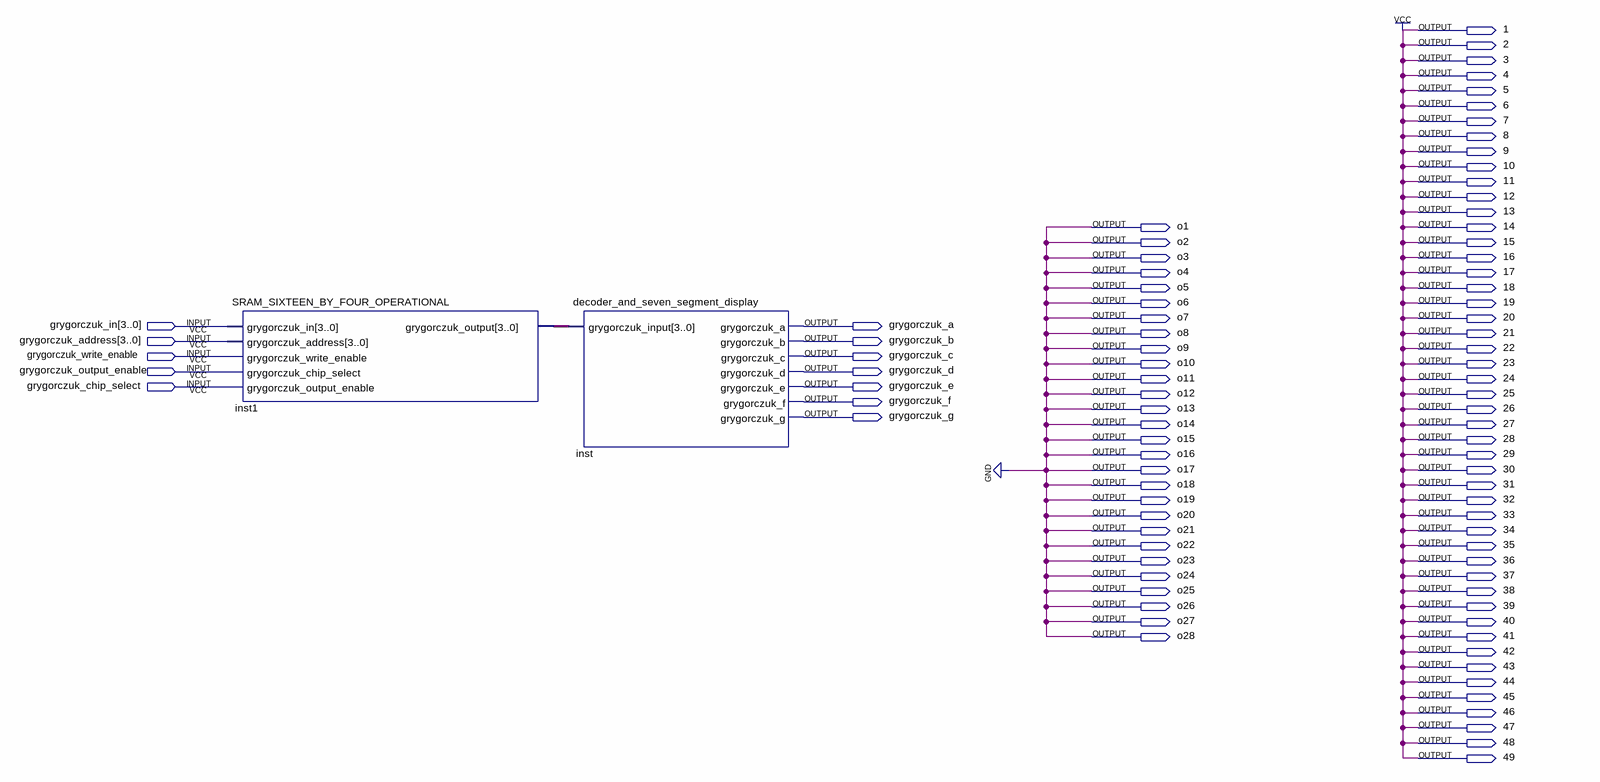
[diagram p0: schematic sheet]
// Quartus schematic SRAM_PINS.bdf as structural Verilog: 2 symbols, 89 pins
module SRAM_PINS (
  input  [3:0] grygorczuk_in,
  input  [3:0] grygorczuk_address,
  input  grygorczuk_write_enable,
  input  grygorczuk_output_enable,
  input  grygorczuk_chip_select,
  output \1 ,
  output \2 ,
  output \3 ,
  output \4 ,
  output \5 ,
  output \6 ,
  output \7 ,
  output \8 ,
  output \9 ,
  output \10 ,
  output \11 ,
  output \12 ,
  output \13 ,
  output o1,
  output \14 ,
  output o2,
  output \15 ,
  output o3,
  output \16 ,
  output o4,
  output \17 ,
  output o5,
  output \18 ,
  output o6,
  output \19 ,
  output o7,
  output \20 ,
  output grygorczuk_a,
  output o8,
  output \21 ,
  output grygorczuk_b,
  output o9,
  output \22 ,
  output grygorczuk_c,
  output o10,
  output \23 ,
  output grygorczuk_d,
  output o11,
  output \24 ,
  output grygorczuk_e,
  output o12,
  output \25 ,
  output grygorczuk_f,
  output o13,
  output \26 ,
  output grygorczuk_g,
  output o14,
  output \27 ,
  output o15,
  output \28 ,
  output o16,
  output \29 ,
  output o17,
  output \30 ,
  output o18,
  output \31 ,
  output o19,
  output \32 ,
  output o20,
  output \33 ,
  output o21,
  output \34 ,
  output o22,
  output \35 ,
  output o23,
  output \36 ,
  output o24,
  output \37 ,
  output o25,
  output \38 ,
  output o26,
  output \39 ,
  output o27,
  output \40 ,
  output o28,
  output \41 ,
  output \42 ,
  output \43 ,
  output \44 ,
  output \45 ,
  output \46 ,
  output \47 ,
  output \48 ,
  output \49 
);

  wire [3:0] inst1_grygorczuk_output;

  SRAM_SIXTEEN_BY_FOUR_OPERATIONAL inst1 (
    .grygorczuk_in(grygorczuk_in), .grygorczuk_address(grygorczuk_address),
    .grygorczuk_write_enable(grygorczuk_write_enable), .grygorczuk_chip_select(grygorczuk_output_enable),
    .grygorczuk_output_enable(grygorczuk_chip_select), .grygorczuk_output(inst1_grygorczuk_output));
  decoder_and_seven_segment_display inst (
    .grygorczuk_input(inst1_grygorczuk_output), .grygorczuk_a(grygorczuk_a), .grygorczuk_b(grygorczuk_b),
    .grygorczuk_c(grygorczuk_c), .grygorczuk_d(grygorczuk_d), .grygorczuk_e(grygorczuk_e),
    .grygorczuk_f(grygorczuk_f), .grygorczuk_g(grygorczuk_g));

  assign \1  = 1'b1;
  assign \2  = 1'b1;
  assign \3  = 1'b1;
  assign \4  = 1'b1;
  assign \5  = 1'b1;
  assign \6  = 1'b1;
  assign \7  = 1'b1;
  assign \8  = 1'b1;
  assign \9  = 1'b1;
  assign \10  = 1'b1;
  assign \11  = 1'b1;
  assign \12  = 1'b1;
  assign \13  = 1'b1;
  assign \14  = 1'b1;
  assign \15  = 1'b1;
  assign \16  = 1'b1;
  assign \17  = 1'b1;
  assign \18  = 1'b1;
  assign \19  = 1'b1;
  assign \20  = 1'b1;
  assign \21  = 1'b1;
  assign \22  = 1'b1;
  assign \23  = 1'b1;
  assign \24  = 1'b1;
  assign \25  = 1'b1;
  assign \26  = 1'b1;
  assign \27  = 1'b1;
  assign \28  = 1'b1;
  assign \29  = 1'b1;
  assign \30  = 1'b1;
  assign \31  = 1'b1;
  assign \32  = 1'b1;
  assign \33  = 1'b1;
  assign \34  = 1'b1;
  assign \35  = 1'b1;
  assign \36  = 1'b1;
  assign \37  = 1'b1;
  assign \38  = 1'b1;
  assign \39  = 1'b1;
  assign \40  = 1'b1;
  assign \41  = 1'b1;
  assign \42  = 1'b1;
  assign \43  = 1'b1;
  assign \44  = 1'b1;
  assign \45  = 1'b1;
  assign \46  = 1'b1;
  assign \47  = 1'b1;
  assign \48  = 1'b1;
  assign \49  = 1'b1;
  assign o1 = 1'b0;
  assign o2 = 1'b0;
  assign o3 = 1'b0;
  assign o4 = 1'b0;
  assign o5 = 1'b0;
  assign o6 = 1'b0;
  assign o7 = 1'b0;
  assign o8 = 1'b0;
  assign o9 = 1'b0;
  assign o10 = 1'b0;
  assign o11 = 1'b0;
  assign o12 = 1'b0;
  assign o13 = 1'b0;
  assign o14 = 1'b0;
  assign o15 = 1'b0;
  assign o16 = 1'b0;
  assign o17 = 1'b0;
  assign o18 = 1'b0;
  assign o19 = 1'b0;
  assign o20 = 1'b0;
  assign o21 = 1'b0;
  assign o22 = 1'b0;
  assign o23 = 1'b0;
  assign o24 = 1'b0;
  assign o25 = 1'b0;
  assign o26 = 1'b0;
  assign o27 = 1'b0;
  assign o28 = 1'b0;
endmodule
